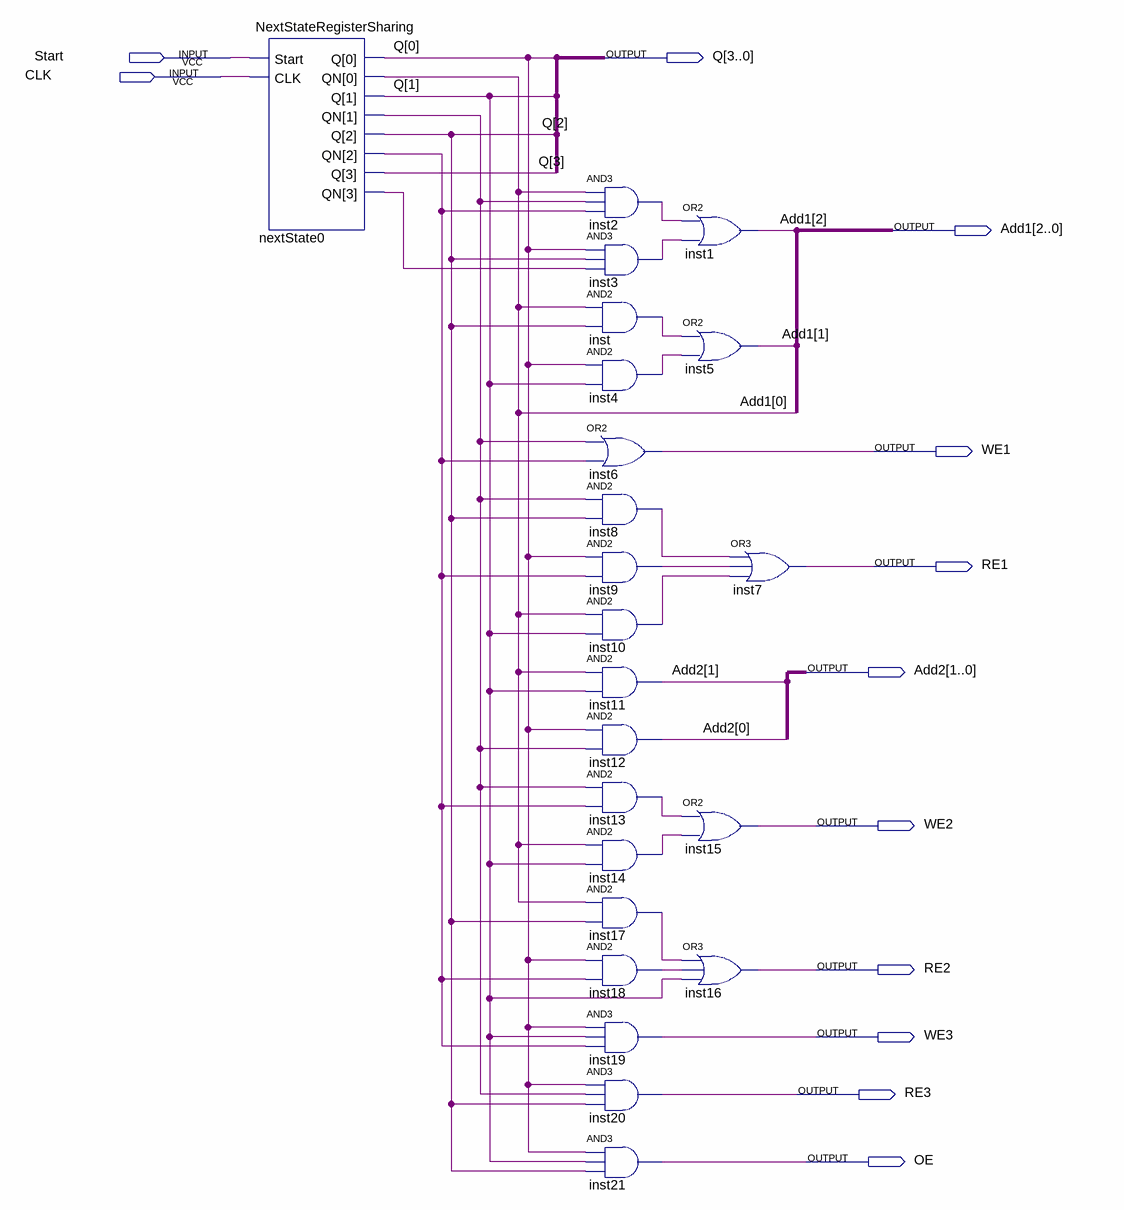
[diagram p0: schematic sheet]
// Quartus schematic ControlRegisterSharing.bdf as structural Verilog: 23 symbols, 12 pins
module ControlRegisterSharing (
  input  Start,
  input  CLK,
  output [3:0] Q,
  output [2:0] Add1,
  output WE1,
  output RE1,
  output [1:0] Add2,
  output WE2,
  output RE2,
  output WE3,
  output RE3,
  output OE
);

  wire inst2_out, inst3_out, inst4_out, inst8_out, inst9_out, inst10_out, inst13_out, inst14_out, inst17_out,
       inst18_out, inst_out, nextState0_qn, nextState0_qn_2, nextState0_qn_3;

  NextStateRegisterSharing nextState0 (
    .Start(Start), .CLK(CLK), .Q(Q), .QN({nextState0_qn, nextState0_qn_2, nextState0_qn_3, Add1[0]}));
  and inst2 (inst2_out, Add1[0], nextState0_qn_3, nextState0_qn_2);
  and inst3 (inst3_out, Q[0], Q[2], nextState0_qn);
  and inst (inst_out, Add1[0], Q[2]);
  and inst4 (inst4_out, Q[0], Q[1]);
  or inst6 (WE1, nextState0_qn_3, nextState0_qn_2);
  and inst8 (inst8_out, nextState0_qn_3, Q[2]);
  and inst9 (inst9_out, Q[0], nextState0_qn_2);
  and inst10 (inst10_out, Add1[0], Q[1]);
  and inst11 (Add2[1], Add1[0], Q[1]);
  and inst12 (Add2[0], Q[0], nextState0_qn_3);
  and inst13 (inst13_out, nextState0_qn_3, nextState0_qn_2);
  and inst14 (inst14_out, Add1[0], Q[1]);
  and inst17 (inst17_out, Add1[0], Q[2]);
  and inst18 (inst18_out, Q[0], nextState0_qn_2);
  and inst19 (WE3, Q[0], Q[1], nextState0_qn_2);
  and inst20 (RE3, Q[0], nextState0_qn_3, Q[2]);
  and inst21 (OE, Q[0], Q[1], Q[2]);
  or inst1 (Add1[2], inst2_out, inst3_out);
  or inst5 (Add1[1], inst_out, inst4_out);
  or inst15 (WE2, inst13_out, inst14_out);
  or inst16 (RE2, inst17_out, inst18_out, Q[1]);
  or inst7 (RE1, inst8_out, inst9_out, inst10_out);
endmodule
